# Altium schematic sheet CATS-Vega-PM.SchDoc: CATS Vega
size A4; DocumentNumber: Overview; Revision: V1.0; SheetNumber: 3; SheetTotal: 16; Author: Luca Jost; Subtitle: Power Management
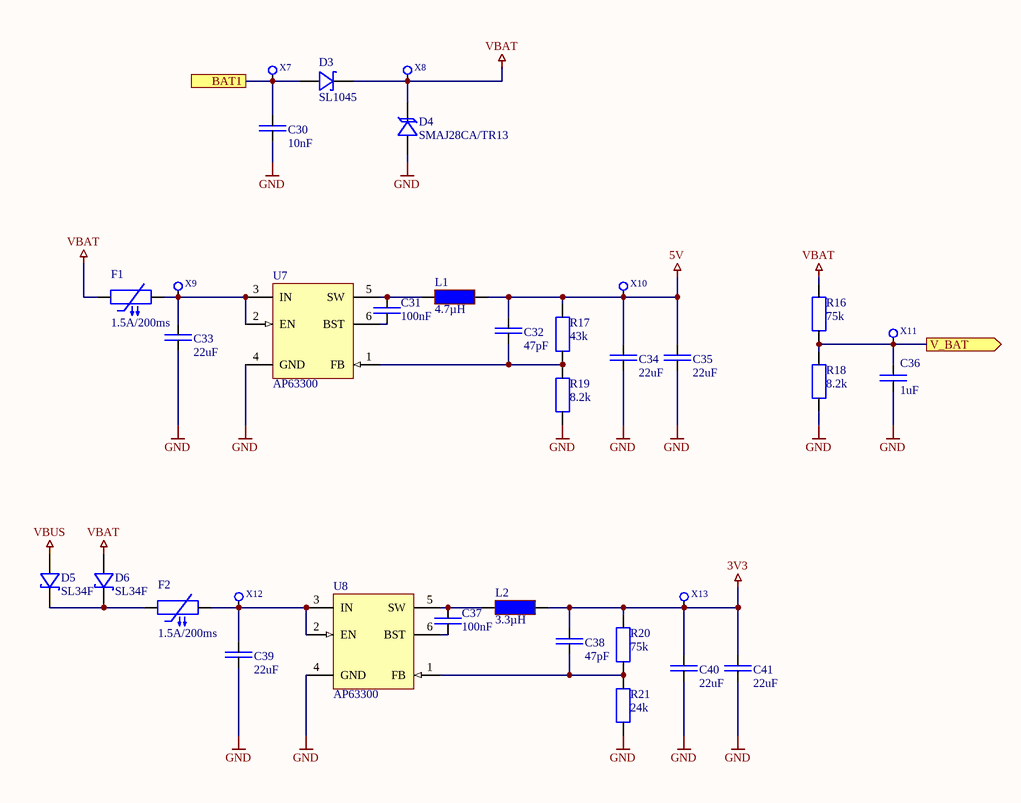
[diagram p0: CATS-Vega-PM.SchDoc]

## Parts
C30  10nF  [SMD Keramikkondensator 0603]
C31  100nF  [SMD Keramikkondensator 0603]
C32  47pF  [SMD Keramikkondensator 0603]
C33  22uF  [SMD Keramikkondensator 0805]
C34  22uF  [SMD Keramikkondensator 0805]
C35  22uF  [SMD Keramikkondensator 0805]
C36  1uF  [SMD Keramikkondensator 0603]
C37  100nF  [SMD Keramikkondensator 0603]
C38  47pF  [SMD Keramikkondensator 0603]
C39  22uF  [SMD Keramikkondensator 0805]
C40  22uF  [SMD Keramikkondensator 0805]
C41  22uF  [SMD Keramikkondensator 0805]
D3  SL1045  [SMD Diode TO-277]
D4  SMAJ28CA/TR13  [SMD Diode DO-214-AC (SMA)]
D5  SL34F  [SMD Diode SMAF]
D6  SL34F  [SMD Diode SMAF]
F1  1.5A/200ms  [SMD PPTC-Fuse 1206]
F2  1.5A/200ms  [SMD PPTC-Fuse 1206]
L1  4.7µH  [SMD Inductor 5.5x5.2x3]
L2  3.3µH  [SMD Inductor 2x2.5x1.2]
R16  75k  [SMD Widerstand 0603]
R17  43k  [SMD Widerstand 0603]
R18  8.2k  [SMD Widerstand 0603]
R19  8.2k  [SMD Widerstand 0603]
R20  75k  [SMD Widerstand 0603]
R21  24k  [SMD Widerstand 0603]
U7  AP63300  [SMD IC TSOT-23-6]
U8  AP63300  [SMD IC TSOT-23-6]
X7  -  [SMD Test point 0.8mm]  (value not drawn)  (no BOM)
X8  -  [SMD Test point 0.8mm]  (value not drawn)  (no BOM)
X9  -  [SMD Test point 0.8mm]  (value not drawn)  (no BOM)
X10  -  [SMD Test point 0.8mm]  (value not drawn)  (no BOM)
X11  -  [SMD Test point 0.8mm]  (value not drawn)  (no BOM)
X12  -  [SMD Test point 0.8mm]  (value not drawn)  (no BOM)
X13  -  [SMD Test point 0.8mm]  (value not drawn)  (no BOM)

## Ports
BAT1, V_BAT (out)

## Nets
3V3: C38.2 C40.2 C41.2 L2.2 R20.2 X13.1
5V: C32.2 C34.2 C35.2 L1.2 R17.2 X10.1
GND: C30.1 C33.1 C34.1 C35.1 C36.1 C39.1 C40.1 C41.1 D4.A R18.1 R19.1 R21.1 U7.4(GND) U8.4(GND)
VBAT: D3.K D4.K D6.A F1.2 R16.2 X8.1
VBUS: D5.A
BAT1: C30.2 D3.A X7.1 ; port BAT1
V_BAT: C36.2 R16.1 R18.2 X11.1 ; port V_BAT
NetC31_1: C31.1 U7.6(BST)
NetC31_2: C31.2 L1.1 U7.5(SW)
NetC32_1: C32.1 R17.1 R19.2 U7.1(FB)
NetC33_2: C33.2 F1.1 U7.2(EN) U7.3(IN) X9.1
NetC37_1: C37.1 U8.6(BST)
NetC37_2: C37.2 L2.1 U8.5(SW)
NetC38_1: C38.1 R20.1 R21.2 U8.1(FB)
NetC39_2: C39.2 F2.1 U8.2(EN) U8.3(IN) X12.1
NetD5_K: D5.K D6.K F2.2

## Notes on the sheet
- Title
- Author:
- Subtitle
- Date:
- Rev:
- File:
- Sheet
- of

## Library data of the parts
C30 = E6 - 10nF: SMD Ceramic Capacitor E6; Unit Price: 0.0015; JLC: C1589
C31 C37 = E6 - 100nF: SMD Ceramic Capacitor E6; Unit Price: 0.0024; JLC: C1591
C32 C38 = E6 - 47pF: SMD Ceramic Capacitor E6; Unit Price: 0.0056; JLC: C1671
C33-C35 C39-C41 = E6 - 22uF: SMD Ceramic Capacitor E6; Unit Price: 0.3453; JLC: C338080
C36 = E6 - 1uF: SMD Ceramic Capacitor E6; Unit Price: 0.0047; JLC: C15849
D3 = SL1045: 45V 470mV@10A 10A TO-277 Schottky Barrier Diodes; ComponentLink1Description: Datasheet; ComponentLink1URL: https://datasheet.lcsc.com/lcsc/1810252210_MDD-Microdiode-Electronics--SL1045_C65021.pdf; JLC: C113945; Unit Price: 0.1199
D4 = SMAJ28CA/TR13: TVS Diode, 31.10~34.40V Breakdown, 8.8A Pulse; ComponentLink1Description: Datasheet; ComponentLink1URL: https://datasheet.lcsc.com/lcsc/1809291411_Brightking-SMAJ28CA-TR13_C90508.pdf; JLC: C90508; Unit Price: 0.0337
D5 D6 = SL34F: 3A SMAF Schottky Barrier Diode; JLC: C60396; ComponentLink1Description: Datasheet; ComponentLink1URL: https://datasheet.lcsc.com/lcsc/1809211527_MDD-Microdiode-Electronics--SL34F_C113938.pdf; Unit Price: 0.0363
F1 F2 = ASMD1206-075-30V: Polymeric PTC Resettable Fuse 30V 0.75A Surface Mount 1206; ComponentLink1Description: Datasheet; ComponentLink1URL: https://datasheet.lcsc.com/lcsc/2204011730_Shenzhen-JDT-Fuse-ASMD1206-075-30V_C2982268.pdf; JLC: C2982268; Unit Price: 0.0525
L1 = Inductor 4.7µH / 4.5A: 4.7 µH Shielded Molded Inductor 4.5 A 60mOhm Max Nonstandard; Digikey: 541-1238-2-ND; ComponentLink1Description: Datasheet; ComponentLink1URL: https://www.vishay.com/docs/34260/ihlp2020cz11.pdf; JLC: C408410; Unit Price: 0.0978
L2 = Inductor 3.3µH / 1.15A: 1.15A 3.3uH ±20% 144mΩ SMD Power Inductors; Digikey: 732-5680-2-ND; ComponentLink1Description: Datasheet; ComponentLink1URL: https://datasheet.lcsc.com/lcsc/2110081330_Sunlord-SPH252012H3R3MT_C98379.pdf; JLC: C98379; Unit Price: 0.0513
R16 R20 = E24 - 75k: SMD Chip Resistor E24; Unit Price: 0.001; JLC: C23242
R17 = E24 - 43k: SMD Chip Resistor E24; Unit Price: 0.001; JLC: C23172
R18 R19 = E24 - 8.2k: SMD Chip Resistor E24; Unit Price: 0.001; JLC: C168409
R21 = E24 - 24k: SMD Chip Resistor E24; Unit Price: 0.001; JLC: C2907131
U7 U8 = AP63300: 3.8V TO 32V INPUT, 3A LOW IQ SYNCHRONOUS BUCK WITH ENHANCED EMI REDUCTION; ComponentLink1Description: Datasheet; ComponentLink1URL: https://www.diodes.com/assets/Datasheets/AP63300-AP63301.pdf; Digikey: 31-AP63300WU-7TR-ND; JLC: C2158012; Mouser: 621-AP63300WU-7; Unit Price: 0.6396
X7-X13 = SMD Test point: Test Point SMD